# Altium schematic sheet ADC_IN.SchDoc
size D
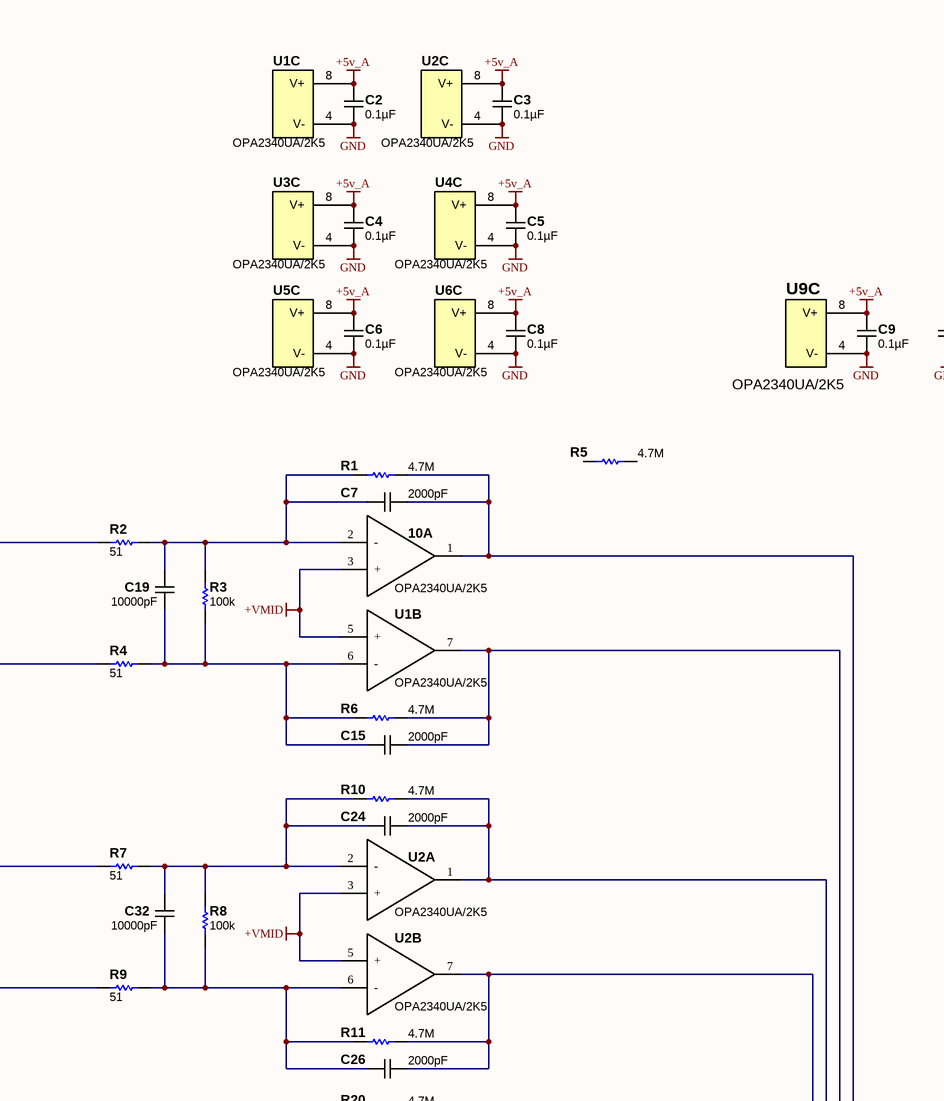
[diagram p0: ADC_IN.SchDoc, top left]
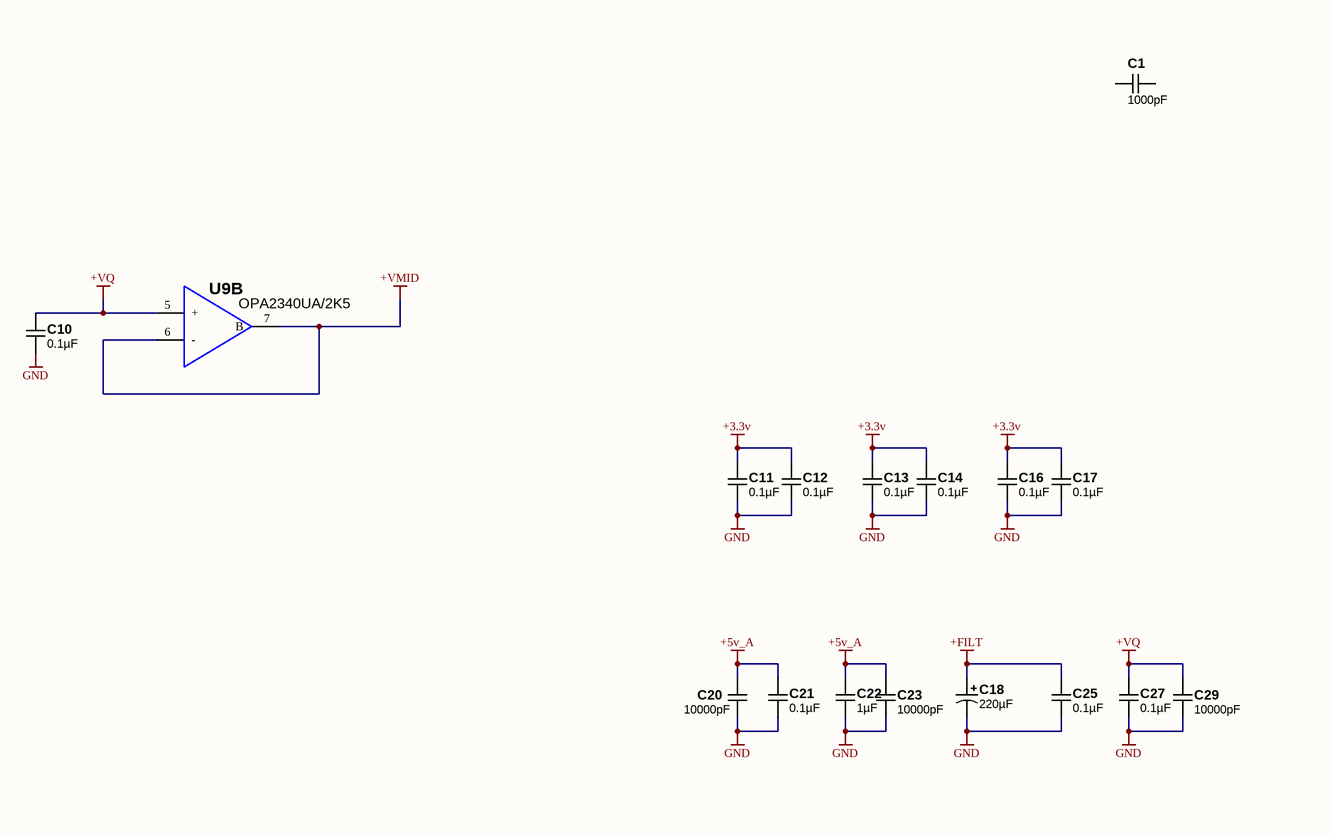
[diagram p1: ADC_IN.SchDoc, top right]
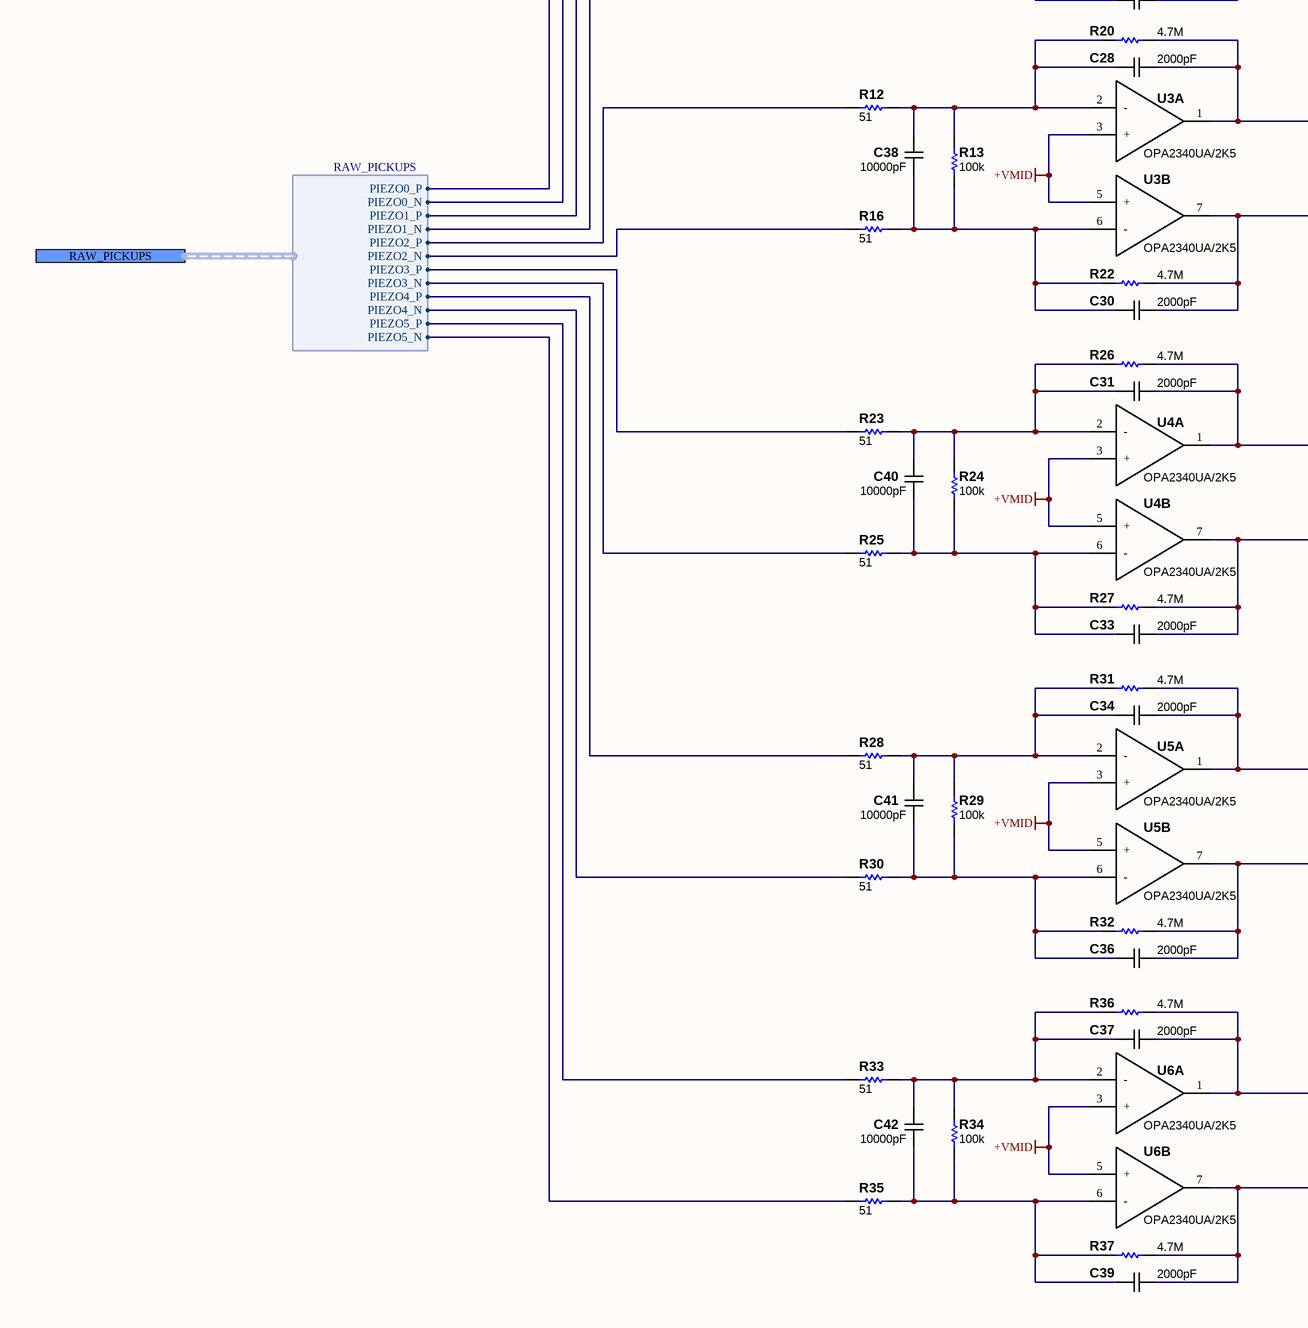
[diagram p2: ADC_IN.SchDoc, bottom left]
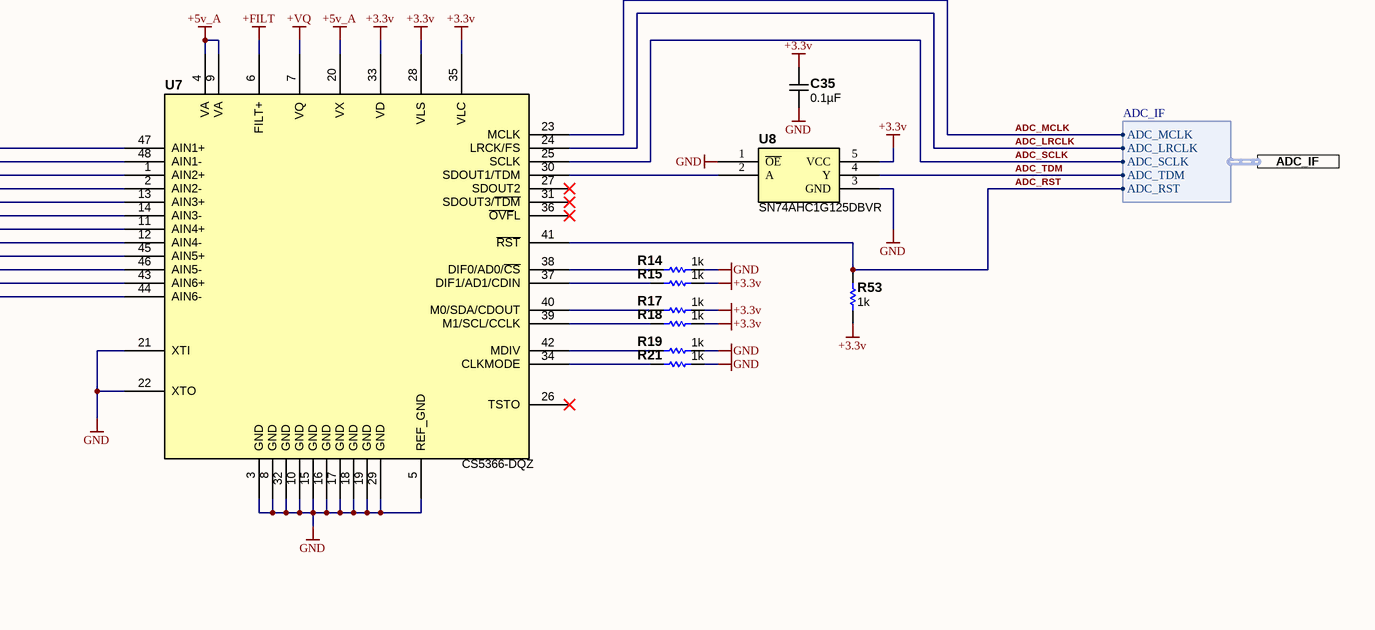
[diagram p3: ADC_IN.SchDoc, bottom right]

## Parts
10  OPA2340UA/2K5  [SOIC 8]  (part A of 3)
C1  1000pF  [C0603_0.90MM_MD]
C2  0.1µF  [C0603_0.90MM_MD]
C3  0.1µF  [C0603_0.90MM_MD]
C4  0.1µF  [C0603_0.90MM_MD]
C5  0.1µF  [C0603_0.90MM_MD]
C6  0.1µF  [C0603_0.90MM_MD]
C7  2000pF  [C0603_MD]
C8  0.1µF  [C0603_0.90MM_MD]
C9  0.1µF  [C0603_0.90MM_MD]
C10  0.1µF  [C0603_0.90MM_MD]
C11  0.1µF  [C0603_0.90MM_MD]
C12  0.1µF  [C0603_0.90MM_MD]
C13  0.1µF  [C0603_0.90MM_MD]
C14  0.1µF  [C0603_0.90MM_MD]
C15  2000pF  [C0603_MD]
C16  0.1µF  [C0603_0.90MM_MD]
C17  0.1µF  [C0603_0.90MM_MD]
C18  220µF  [C_TANT_D_HD]
C19  10000pF  [C0603_0.90MM_MD]
C20  10000pF  [C0603_0.90MM_MD]
C21  0.1µF  [C0603_0.90MM_MD]
C22  1µF  [C0603_0.90MM_MD]
C23  10000pF  [C0603_0.90MM_MD]
C24  2000pF  [C0603_MD]
C25  0.1µF  [C0603_0.90MM_MD]
C26  2000pF  [C0603_MD]
C27  0.1µF  [C0603_0.90MM_MD]
C28  2000pF  [C0603_MD]
C29  10000pF  [C0603_0.90MM_MD]
C30  2000pF  [C0603_MD]
C31  2000pF  [C0603_MD]
C32  10000pF  [C0603_0.90MM_MD]
C33  2000pF  [C0603_MD]
C34  2000pF  [C0603_MD]
C35  0.1µF  [C0603_0.90MM_MD]
C36  2000pF  [C0603_MD]
C37  2000pF  [C0603_MD]
C38  10000pF  [C0603_0.90MM_MD]
C39  2000pF  [C0603_MD]
C40  10000pF  [C0603_0.90MM_MD]
C41  10000pF  [C0603_0.90MM_MD]
C42  10000pF  [C0603_0.90MM_MD]
R1  4.7M  [R0603_MD]
R2  51  [R0603_MD]
R3  100k  [R0603_MD]
R4  51  [R0603_MD]
R5  4.7M  [R0603_MD]
R6  4.7M  [R0603_MD]
R7  51  [R0603_MD]
R8  100k  [R0603_MD]
R9  51  [R0603_MD]
R10  4.7M  [R0603_MD]
R11  4.7M  [R0603_MD]
R12  51  [R0603_MD]
R13  100k  [R0603_MD]
R14  1k  [R0603_MD]
R15  1k  [R0603_MD]
R16  51  [R0603_MD]
R17  1k  [R0603_MD]
R18  1k  [R0603_MD]
R19  1k  [R0603_MD]
R20  4.7M  [R0603_MD]
R21  1k  [R0603_MD]
R22  4.7M  [R0603_MD]
R23  51  [R0603_MD]
R24  100k  [R0603_MD]
R25  51  [R0603_MD]
R26  4.7M  [R0603_MD]
R27  4.7M  [R0603_MD]
R28  51  [R0603_MD]
R29  100k  [R0603_MD]
R30  51  [R0603_MD]
R31  4.7M  [R0603_MD]
R32  4.7M  [R0603_MD]
R33  51  [R0603_MD]
R34  100k  [R0603_MD]
R35  51  [R0603_MD]
R36  4.7M  [R0603_MD]
R37  4.7M  [R0603_MD]
R53  1k  [R0603_MD]
U1  OPA2340UA/2K5  [SOIC 8]  (parts B,C of 3)
U2  OPA2340UA/2K5  [SOIC 8]  (parts A,B,C of 3)
U3  OPA2340UA/2K5  [SOIC 8]  (parts A,B,C of 3)
U4  OPA2340UA/2K5  [SOIC 8]  (parts A,B,C of 3)
U5  OPA2340UA/2K5  [SOIC 8]  (parts A,B,C of 3)
U6  OPA2340UA/2K5  [SOIC 8]  (parts A,B,C of 3)
U7  CS5366-DQZ  [TSQFP50P900X900X145-48L]
U8  SN74AHC1G125DBVR  [SOT23-5]
U9  OPA2340UA/2K5  [SOIC 8]  (parts B,C of 3)

## Ports
ADC_IF (harness ADC_IF), RAW_PICKUPS (harness RAW_PICKUPS)

## Harnesses
RAW_PICKUPS: PIEZO0_N, PIEZO0_P, PIEZO1_P, PIEZO1_N, PIEZO2_P, PIEZO2_N, PIEZO3_P, PIEZO3_N, PIEZO4_P, PIEZO4_N, PIEZO5_P, PIEZO5_N
ADC_IF: ADC_MCLK, ADC_LRCLK, ADC_SCLK, ADC_TDM, ADC_RST

## Nets
+3.3v: C11.2 C12.2 C13.2 C14.2 C16.2 C17.2 C35.2 R15.1 R17.1 R18.1 R53.1 U7.28(VLS) U7.33(VD) U7.35(VLC) U8.5(VCC)
+5v_A: C2.2 C3.2 C4.2 C5.2 C6.2 C8.2 C9.2 C20.2 C21.2 C22.2 C23.1 U1.8(V+) U2.8(V+) U3.8(V+) U4.8(V+) U5.8(V+) U6.8(V+) U7.4(VA) U7.9(VA) U7.20(VX) U9.8(V+)
+FILT: C18.1 C25.2 U7.6(FILT+)
+VMID: 10.3(+) U1.5(+) U2.3(+) U2.5(+) U3.3(+) U3.5(+) U4.3(+) U4.5(+) U5.3(+) U5.5(+) U6.3(+) U6.5(+) U9.6(-) U9.7(B)
+VQ: C10.2 C27.2 C29.1 U7.7(VQ) U9.5(+)
GND: C2.1 C3.1 C4.1 C5.1 C6.1 C8.1 C9.1 C10.1 C11.1 C12.1 C13.1 C14.1 C16.1 C17.1 C18.2 C20.1 C21.1 C22.1 C23.2 C25.1 C27.1 C29.2 C35.1 R14.1 R19.1 R21.1 U1.4(V-) U2.4(V-) U3.4(V-) U4.4(V-) U5.4(V-) U6.4(V-) U7.3(GND) U7.5(REF_GND) U7.8(GND) U7.10(GND) U7.15(GND) U7.16(GND) U7.17(GND) U7.18(GND) U7.19(GND) U7.21(XTI) U7.22(XTO) U7.29(GND) U7.32(GND) U8.1(~{OE}) U8.3(GND) U9.4(V-)
ADC_LRCLK: U7.24(LRCK/FS) ; port ADC_IF.ADC_LRCLK
ADC_MCLK: U7.23(MCLK) ; port ADC_IF.ADC_MCLK
ADC_RST: R53.2 U7.41(~{RST}) ; port ADC_IF.ADC_RST
ADC_SCLK: U7.25(SCLK) ; port ADC_IF.ADC_SCLK
ADC_TDM: U8.4(Y) ; port ADC_IF.ADC_TDM
Net10_1: 10.1(A) C7.2 R1.2 U7.43(AIN6+)
Net10_2: 10.2(-) C7.1 C19.2 R1.1 R2.2 R3.2
NetC15_1: C15.1 C19.1 R3.1 R4.2 R6.1 U1.6(-)
NetC15_2: C15.2 R6.2 U1.7(B) U7.44(AIN6-)
NetC24_1: C24.1 C32.2 R7.2 R8.2 R10.1 U2.2(-)
NetC24_2: C24.2 R10.2 U2.1(A) U7.45(AIN5+)
NetC26_1: C26.1 C32.1 R8.1 R9.2 R11.1 U2.6(-)
NetC26_2: C26.2 R11.2 U2.7(B) U7.46(AIN5-)
NetC28_1: C28.1 C38.2 R12.2 R13.2 R20.1 U3.2(-)
NetC28_2: C28.2 R20.2 U3.1(A) U7.47(AIN1+)
NetC30_1: C30.1 C38.1 R13.1 R16.2 R22.1 U3.6(-)
NetC30_2: C30.2 R22.2 U3.7(B) U7.48(AIN1-)
NetC31_1: C31.1 C40.2 R23.2 R24.2 R26.1 U4.2(-)
NetC31_2: C31.2 R26.2 U4.1(A) U7.1(AIN2+)
NetC33_1: C33.1 C40.1 R24.1 R25.2 R27.1 U4.6(-)
NetC33_2: C33.2 R27.2 U4.7(B) U7.2(AIN2-)
NetC34_1: C34.1 C41.2 R28.2 R29.2 R31.1 U5.2(-)
NetC34_2: C34.2 R31.2 U5.1(A) U7.11(AIN4+)
NetC36_1: C36.1 C41.1 R29.1 R30.2 R32.1 U5.6(-)
NetC36_2: C36.2 R32.2 U5.7(B) U7.12(AIN4-)
NetC37_1: C37.1 C42.2 R33.2 R34.2 R36.1 U6.2(-)
NetC37_2: C37.2 R36.2 U6.1(A) U7.13(AIN3+)
NetC39_1: C39.1 C42.1 R34.1 R35.2 R37.1 U6.6(-)
NetC39_2: C39.2 R37.2 U6.7(B) U7.14(AIN3-)
NetR2_1: R2.1 ; port RAW_PICKUPS.PIEZO0_P
NetR4_1: R4.1 ; port RAW_PICKUPS.PIEZO0_N
NetR7_1: R7.1 ; port RAW_PICKUPS.PIEZO1_P
NetR9_1: R9.1 ; port RAW_PICKUPS.PIEZO1_N
NetR12_1: R12.1 ; port RAW_PICKUPS.PIEZO2_P
NetR14_2: R14.2 U7.38(DIF0/AD0/~{CS})
NetR15_2: R15.2 U7.37(DIF1/AD1/CDIN)
NetR16_1: R16.1 ; port RAW_PICKUPS.PIEZO2_N
NetR17_2: R17.2 U7.40(M0/SDA/CDOUT)
NetR18_2: R18.2 U7.39(M1/SCL/CCLK)
NetR19_2: R19.2 U7.42(MDIV)
NetR21_2: R21.2 U7.34(CLKMODE)
NetR23_1: R23.1 ; port RAW_PICKUPS.PIEZO3_P
NetR25_1: R25.1 ; port RAW_PICKUPS.PIEZO3_N
NetR28_1: R28.1 ; port RAW_PICKUPS.PIEZO4_P
NetR30_1: R30.1 ; port RAW_PICKUPS.PIEZO4_N
NetR33_1: R33.1 ; port RAW_PICKUPS.PIEZO5_P
NetR35_1: R35.1 ; port RAW_PICKUPS.PIEZO5_N
NetU7_30: U7.30(SDOUT1/TDM) U8.2(A)

Not connected (* = marked no-connect by the designer): C1 1 2(1); R5 1 2; U7 26(TSTO)* 27(SDOUT2)* 31(SDOUT3/~{TDM})* 36(~{OVF}L)*

## Notes on the sheet
- Title
- Size:
- Date:
- File:
- D
- Number:
- Time:
- Revision:
- Sheet
- of

## Library data of the parts
10 U1-U6 U9 = OPA2340UA/2K5: IC OPAMP GP 5.5MHZ RRO 8SOIC; Manufacturer: Texas Instruments; Amplifier Type: General Purpose; Number of Circuits: 2; Output Type: Rail-to-Rail; Slew Rate: 6 V/µs; Current - Input Bias: 0.2pA; Voltage - Input Offset: 150µV; Current - Supply: 750µA; Current - Output / Channel: 50mA; Voltage - Supply, Single/Dual (±): 2.5 V ~ 5.5 V; Value: OPA2340UA/2K5; Supplier 1: Digi-Key; Supplier Part Number 1: 296-26254-1-ND; Manufacturer Part Number: OPA2340UA/2K5; RoHS: RoHS Compliant; Category: Integrated Circuits (ICs); Stock 1: 1425; Pricing 1: 1=3.51, 10=3.148, 25=2.8304, 100=2.5742, 250=2.3302, 500=2.0862, 750=1.891, 1000=1.7568 (USD); Packaging: Cut Tape (CT); Gain Bandwidth Product: 5.5MHz; -3db Bandwidth: -; Operating Temperature: -40°C ~ 85°C; Mounting Type: Surface Mount; Package / Case: 8-SOIC (0.154", 3.90mm Width); Supplier Device Package: 8-SOIC; ComponentLink1URL: http://www.ti.com/lit/ds/symlink/opa2340.pdf; ComponentLink1Description: http://www.ti.com/lit/ds/symlink/opa2340.pdf
C1 = CL10C102FB8NNNC: CAP CER 1000PF 50V C0G/NP0 0603; Manufacturer: Samsung Electro-Mechanics; Temperature Coefficient: C0G, NP0; Tolerance: ±1%; Substitution Notes: 1000pF , 50V , ±1% , C0G, NP0 , -55°C ~ 125°C,0603; Value: 1000pF; Manufacturer Part Number: CL10C102FB8NNNC; ComponentLink1Description: Datasheet (Internal); ComponentLink1URL: datasheets\Samsung\CL05B153KB5VPNC.pdf.pdf; ComponentLink2Description: Datasheet (External); ComponentLink2URL: http://www.samsungsem.com/kr/support/product-search/mlcc/__icsFiles/afieldfile/2017/05/25/CL05B153KB5VPNC.pdf; Supplier 1: Digikey; Supplier Part Number 1: 1276-6824-1-ND; Category: Capacitors; Voltage - Rated: 50V; Operating Temperature: -55°C ~ 125°C; Ratings: -; Package: 0603; Thickness (Max): 0.90MM
C2-C6 C8-C14 C16 C17 C21 C25 C27 C35 = CGA3E2X7R1H104K080AA: CAP CER 0.1UF 50V X7R 0603; Manufacturer: TDK Corporation; Tolerance: ±10%; Substitution Notes: 0.1µF , 50V , ±10% , X7R , -55°C ~ 125°C , AEC-Q200 , 0603; Value: 0.1µF; Temperature Coefficient: X7R; Manufacturer Part Number: CGA3E2X7R1H104K080AA; ComponentLink1Description: Datasheet (Internal); ComponentLink1URL: datasheets\TDK\mlcc_automotive_general_en.pdf; ComponentLink2Description: Datasheet (External); ComponentLink2URL: https://product.tdk.com/info/en/catalog/datasheets/mlcc_automotive_general_en.pdf; Supplier 1: Digikey; Supplier Part Number 1: 445-5666-1-ND; Category: Capacitors; Voltage - Rated: 50V; Features: -; Operating Temperature: -55°C ~ 125°C; Ratings: AEC-Q200; Package: 0603; Thickness (Max): 0.90MM
C7 C15 C24 C26 C28 C30 C31 C33 C34 C36 C37 C39 = GRM1885C1H202JA01D: CAP CER 2000PF 50V 5% NP0 0603; Manufacturer: Murata Electronics North America; Temperature Coefficient: C0G- NP0; Value: 2000pF; Manufacturer Part Number: GRM1885C1H202JA01D; ComponentLink1Description: \\altium.sil.arl.psu.edu\Libraries\datasheets\Murata Electronics North America\GRM1885C1H202JA01%23.pdf; ComponentLink1URL: http://search.murata.co.jp/Ceramy/image/img/A01X/G101/ENG/GRM1555C1HR60WA01-01.pdf; ComponentLink2Description: External Datasheet; ComponentLink2URL: http://psearch.murata.com/capacitor/product/GRM1885C1H202JA01%23.pdf; Stocked: 0; Supplier 1: Digi-Key; Supplier Part Number 1: 490-1458-1-ND; Category: Capacitors; Sort Value: 2000; Sort Value Package: 0603_2000; Pricing: 1 = 0.13  ;  10 = 0.09  ;  50 = 0.0518  ;  100 = 0.0428  ;  250 = 0.036  ;  500 = 0.03016  ;  1000 = 0.02475 (USD); Sales Status: Active; Capacitance: 2000pF; Voltage - Rated: 50V; Tolerance: ±5%; Mounting Type: Surface Mount- MLCC; Operating Temperature: -55°C ~ 125°C; Applications: General Purpose; Ratings: -; Package: 0603 (1608 Metric); Size / Dimension: 0.063" L x 0.031" W (1.60mm x 0.80mm); Height - Seated (Max): -; Thickness (Max): 0.035" (0.90mm); Lead Spacing: -; Features: -; Packaging: Cut Tape (CT); Lead Style: -; Supplier Package: 0603; Thickness: 90; Value_Voltage: 2000pF  50V
C18 = T495D227K010ATE125: CAP TANT 220UF 10V 10% 2917; Manufacturer: Kemet; ESR (Equivalent Series Resistance): 125 mOhm; Type: Molded; F40: T; Value_Voltage: 220µF  10V  125 mOhm; Value: 220µF; Temperature Coefficient: Temperature Coefficient; Manufacturer Part Number: T495D227K010ATE125; ComponentLink1Description: Internal Datasheet; ComponentLink1URL: http://www.kemet.com/datasheets&T495D227K010ATE125; ComponentLink2Description: External Datasheet; ComponentLink2URL: http://www.kemet.com/datasheets&T495D227K010ATE125; Stocked: 0; Supplier 1: Digi-Key; Supplier Part Number 1: 399-3881-1-ND; Category: Capacitors; Sort Value: 220000000; Sort Value Package: D_220000000; Pricing: 1 = 1.68  ;  10 = 1.329  ;  50 = 1.1518  ;  100 = 0.9968  ;  250 = 0.886 (USD); Sales Status: Active; Capacitance: 220µF; Voltage - Rated: 10V; Tolerance: ±10%; Operating Temperature: -55°C ~ 125°C; Mounting Type: Surface Mount; Package: 2917 (7343 Metric); Size / Dimension: 0.287" L x 0.169" W (7.30mm x 4.30mm); Height - Seated (Max): 0.122" (3.10mm); Lead Spacing: -; Supplier Package: D; Features: General Purpose; Packaging: Cut Tape (CT); Lifetime @ Temp#: -
C19 C20 C23 C29 C32 C38 C40-C42 = CGA3E2X7R1H103K080AA: CAP CER 10000PF 50V X7R 0603; Manufacturer: TDK Corporation; Tolerance: ±10%; Substitution Notes: 10000pF , 50V , ±10% , X7R , -55°C ~ 125°C , AEC-Q200 , 0603; Value: 10000pF; Temperature Coefficient: X7R; Manufacturer Part Number: CGA3E2X7R1H103K080AA; ComponentLink1Description: Datasheet (Internal); ComponentLink1URL: datasheets\TDK\mlcc_automotive_general_en.pdf; ComponentLink2Description: Datasheet (External); ComponentLink2URL: https://product.tdk.com/info/en/catalog/datasheets/mlcc_automotive_general_en.pdf; Supplier 1: Digikey; Supplier Part Number 1: 445-5662-1-ND; Category: Capacitors; Voltage - Rated: 50V; Features: -; Operating Temperature: -55°C ~ 125°C; Ratings: AEC-Q200; Package: 0603; Thickness (Max): 0.90MM
C22 = CGA3E1X7R1E105K080AC: CAP CER 1UF 25V X7R 0603; Manufacturer: TDK Corporation; Tolerance: ±10%; Substitution Notes: 1µF , 25V , ±10% , X7R , -55°C ~ 125°C , AEC-Q200 , 0603; Value: 1µF; Temperature Coefficient: X7R; Manufacturer Part Number: CGA3E1X7R1E105K080AC; ComponentLink1Description: Datasheet (Internal); ComponentLink1URL: datasheets\TDK\mlcc_automotive_general_en.pdf; ComponentLink2Description: Datasheet (External); ComponentLink2URL: https://product.tdk.com/info/en/catalog/datasheets/mlcc_automotive_general_en.pdf; Supplier 1: Digikey; Supplier Part Number 1: 445-6931-1-ND; Category: Capacitors; Voltage - Rated: 25V; Features: -; Operating Temperature: -55°C ~ 125°C; Ratings: AEC-Q200; Package: 0603; Thickness (Max): 0.90MM
R1 R5 R6 R10 R11 R20 R22 R26 R27 R31 R32 R36 R37 = RC0603FR-074M7L: RES SMD 4.7M OHM 1% 1/10W 0603; Manufacturer: Yageo; Power Rating: 100mW; Voltage Rating: 50V; Resistance: 4.7MR; Temperature Coefficient: 100ppm/°C; Value: 4.7M; Supplier 1: Digi-Key; Supplier Part Number 1: 311-4.70MHRCT-ND; Manufacturer Part Number: RC0603FR-074M7L; Stock 1: 774342; Pricing 1: 1=0.1, 10=0.015, 100=0.006, 1000=0.00268, 2500=0.00233 (USD); Case/Package: 0603; Number of Pins: 2; Case Code (Imperial): 0603; Case Code (Metric): 1608; Min Operating Temperature: -55°C; Max Operating Temperature: 155°C; Tolerance: 1%; Voltage Rating (DC): 50V; Packaging: Tape and Reel; Termination: SMD/SMT; Composition: Thick Film; Military Standard: Not; Length: 1.6mm; Height: 0.45mm; Width: 0.8mm; Depth: 0.8mm; REACH SVHC: No SVHC; Lead Free: Lead Free; ComponentLink1URL: https://datasheet.ciiva.com/11819/0900766b80f96399-11819362.pdf; ComponentLink1Description: https://datasheet.ciiva.com/11819/0900766b80f96399-11819362.pdf; ComponentLink2URL: https://datasheet.ciiva.com/15189/getdatasheetpartid-328863-15189765.pdf; ComponentLink2Description: https://datasheet.ciiva.com/15189/getdatasheetpartid-328863-15189765.pdf; ComponentLink3URL: https://datasheet.ciiva.com/7746/443971-7746367.pdf; ComponentLink3Description: https://datasheet.ciiva.com/7746/443971-7746367.pdf
R2 R4 R7 R9 R12 R16 R23 R25 R28 R30 R33 R35 = ERJ-3EKF51R0V: RES 51 OHM 1/10W 1% 0603 SMD; Manufacturer: Panasonic Electronic Components; Package Power: 0603  (0.1W); Power (Watts): 0.1W- 1/10W; Temperature Coefficient: ±100ppm/°C; Limiting Element Voltage: 75; Maximum Overload Voltage: 150; Maximum Working Voltage: 2.3V; Value: 51; Manufacturer Part Number: ERJ-3EKF51R0V; ComponentLink1Description: Internal Datasheet; ComponentLink1URL: \\altium.sil.arl.psu.edu\Libraries\datasheets\Panasonic Electronic Components\AOA0000CE2.pdf; ComponentLink2Description: External Datasheet; ComponentLink2URL: http://industrial.panasonic.com/www-data/pdf/AOA0000/AOA0000CE2.pdf; Stocked: 0; Supplier 1: Digi-Key; Supplier Part Number 1: P51.0HCT-ND; Category: Resistors; Resistance (Ohms): 51; Composition: Thick Film; Features: -; Tolerance: ±1%; Package: 0603 (1608 Metric); Supplier Package: 603; Size / Dimension: 0.063" L x 0.031" W (1.60mm x 0.80mm); Height: 0.022" (0.55mm); Number of Terminations: 2; Packaging: Cut Tape (CT); Sort Value: 51; Sort Value Package: 603_51
R3 R8 R13 R24 R29 R34 = ERJ-3EKF1003V: RES 100K OHM 1/10W 1% 0603 SMD; Manufacturer: Panasonic Electronic Components; Package Power: 0603  (0.1W); Power (Watts): 0.1W- 1/10W; Temperature Coefficient: ±100ppm/°C; Limiting Element Voltage: 75; Maximum Overload Voltage: 150; Maximum Working Voltage: 75.0V; Value: 100k; Manufacturer Part Number: ERJ-3EKF1003V; ComponentLink1Description: Internal Datasheet; ComponentLink1URL: \\altium.sil.arl.psu.edu\Libraries\datasheets\Panasonic Electronic Components\AOA0000CE2.pdf; ComponentLink2Description: External Datasheet; ComponentLink2URL: http://industrial.panasonic.com/www-data/pdf/AOA0000/AOA0000CE2.pdf; Stocked: 0; Supplier 1: Digi-Key; Supplier Part Number 1: P100KHCT-ND; Category: Resistors; Resistance (Ohms): 100k; Composition: Thick Film; Features: -; Tolerance: ±1%; Package: 0603 (1608 Metric); Supplier Package: 603; Size / Dimension: 0.063" L x 0.031" W (1.60mm x 0.80mm); Height: 0.022" (0.55mm); Number of Terminations: 2; Packaging: Cut Tape (CT); Sort Value: 100000; Sort Value Package: 603_100000
R14 R15 R17-R19 R21 R53 = ERJ-3EKF1001V: RES 1K OHM 1/10W 1% 0603 SMD; Manufacturer: Panasonic Electronic Components; Package Power: 0603  (0.1W); Power (Watts): 0.1W- 1/10W; Temperature Coefficient: ±100ppm/°C; Limiting Element Voltage: 75; Maximum Overload Voltage: 150; Maximum Working Voltage: 10.0V; Value: 1k; Manufacturer Part Number: ERJ-3EKF1001V; ComponentLink1Description: Internal Datasheet; ComponentLink1URL: \\altium.sil.arl.psu.edu\Libraries\datasheets\Panasonic Electronic Components\AOA0000CE2.pdf; ComponentLink2Description: External Datasheet; ComponentLink2URL: http://industrial.panasonic.com/www-data/pdf/AOA0000/AOA0000CE2.pdf; Stocked: 0; Supplier 1: Digi-Key; Supplier Part Number 1: P1.00KHCT-ND; Category: Resistors; Resistance (Ohms): 1k; Composition: Thick Film; Features: -; Tolerance: ±1%; Package: 0603 (1608 Metric); Supplier Package: 603; Size / Dimension: 0.063" L x 0.031" W (1.60mm x 0.80mm); Height: 0.022" (0.55mm); Number of Terminations: 2; Packaging: Cut Tape (CT); Sort Value: 1000; Sort Value Package: 603_1000
U7 = CS5366-DQZ: Audio A/D Converter ICs 114dB 192kHz 6-Ch ADC w/TDM Interface; Manufacturer: Cirrus Logic; Number of Converters: 1; Resolution: 24 bit; Conversion Rate: 192 kS/s; SNR: No; Number of ADC Inputs: 6; Operating Supply Voltage: 5 V; Supply Voltage - Max: 5.25 V; Supply Voltage - Min: 4.75 V; Value: CS5366-DQZ; Supplier 1: Mouser; Supplier Part Number 1: 777-CS5366-DQZ; Manufacturer Part Number: CS5366-DQZ; RoHS: RoHS Compliant; Category: Audio A/D Converter ICs; Stock 1: 0; Pricing 1: 168=20.52, 250=18.89, 500=17.91 (AUD); Package / Case: LQFP-48; Packaging: Tube; Series: CS5366; Brand: Cirrus Logic; Mounting Style: SMD/SMT; Maximum Operating Temperature: + 105 C; Minimum Operating Temperature: - 40 C; Product Category: Converters - Analog to Digital (ADC); Standard Pack Qty: 250; Tradename: CS5366; RoHS - Mouser: Y; Minimum Order Quantity: 168; Reeling: False; ComponentLink1URL: http://www.mouser.com/ds/2/76/CirrusLogic_CS5366_F5-356671.pdf; ComponentLink1Description: http://www.mouser.com/ds/2/76/CirrusLogic_CS5366_F5-356671.pdf
U8 = SN74AHC1G125DBVR: IC BUS BUFF TRI-ST N-INV SOT235; Manufacturer: Texas Instruments; Logic Type: Buffer/Line Driver, Non-Inverting; Number of Elements: 1; Current - Output High, Low: 8mA, 8mA; Voltage - Supply: 2 V ~ 5.5 V; Supplier 1: Digi-Key; Supplier Part Number 1: 296-8744-1-ND; Manufacturer Part Number: SN74AHC1G125DBVR; RoHS: RoHS Compliant; Category: Integrated Circuits (ICs); Stock 1: 40446; Pricing 1: 1=0.53, 25=0.31, 100=0.25, 250=0.18, 500=0.145, 1000=0.1125 (USD); Number of Bits per Element: 1; Operating Temperature: -40°C ~ 85°C; Mounting Type: Surface Mount; Package / Case: SC-74A, SOT-753; Supplier Device Package: SOT-23-5; Packaging: Cut Tape (CT); ComponentLink1URL: http://www.ti.com/lit/ds/symlink/sn74ahc1g125.pdf; ComponentLink1Description: http://www.ti.com/lit/ds/symlink/sn74ahc1g125.pdf; Value: SN74AHC1G125DBVR